# Altium project PCB_GREAT.PrjPCB
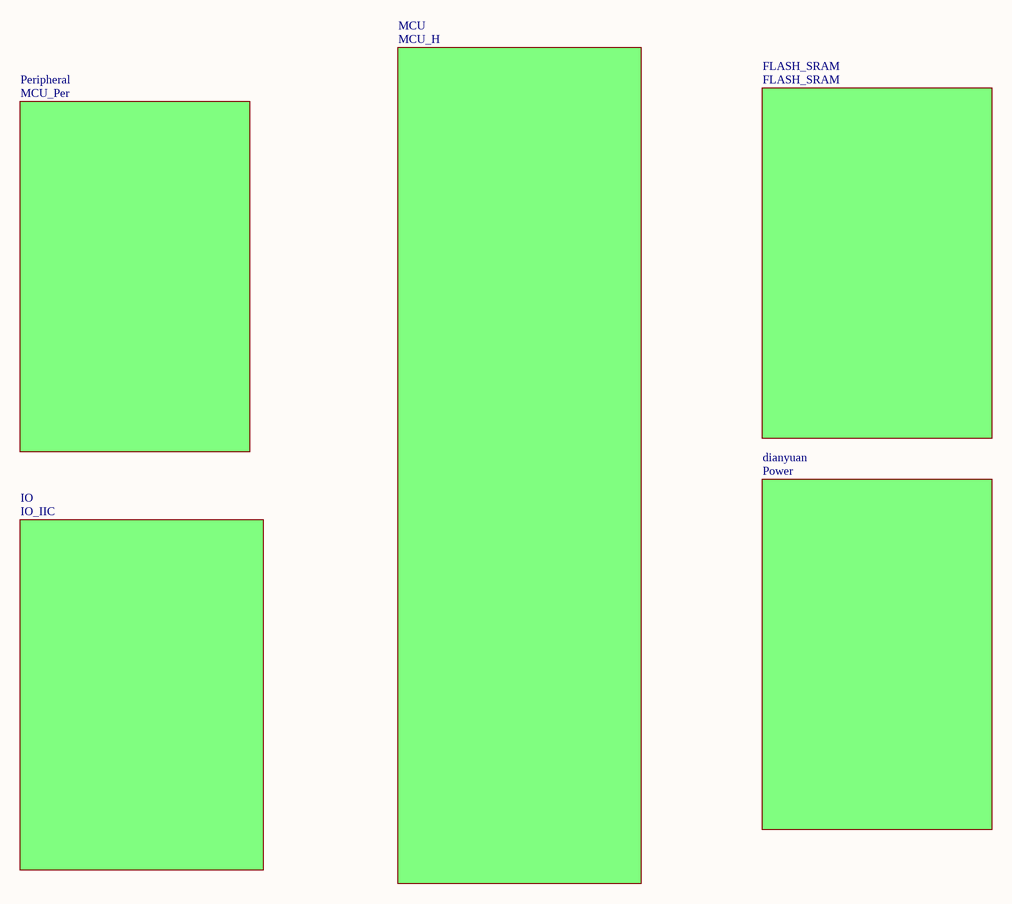
[diagram p0: H_TOP.SchDoc]
3 sheets, 67 parts. Net scope: flat (ports and power ports of the same name join across sheets).
Board file: F_300.PcbDoc
Sheets:
  H_TOP.SchDoc
    MCU = MCU_H.SchDoc
    FLASH_SRAM = FLASH_SRAM.SchDoc

## Sheet H_TOP.SchDoc
size A3

### Sub-sheets
dianyuan = Power (file not in this document): no entries
FLASH_SRAM = FLASH_SRAM: no entries
IO = IO_IIC (file not in this document): no entries
MCU = MCU_H: no entries
Peripheral = MCU_Per (file not in this document): no entries

## Sheet MCU_H.SchDoc
size A3
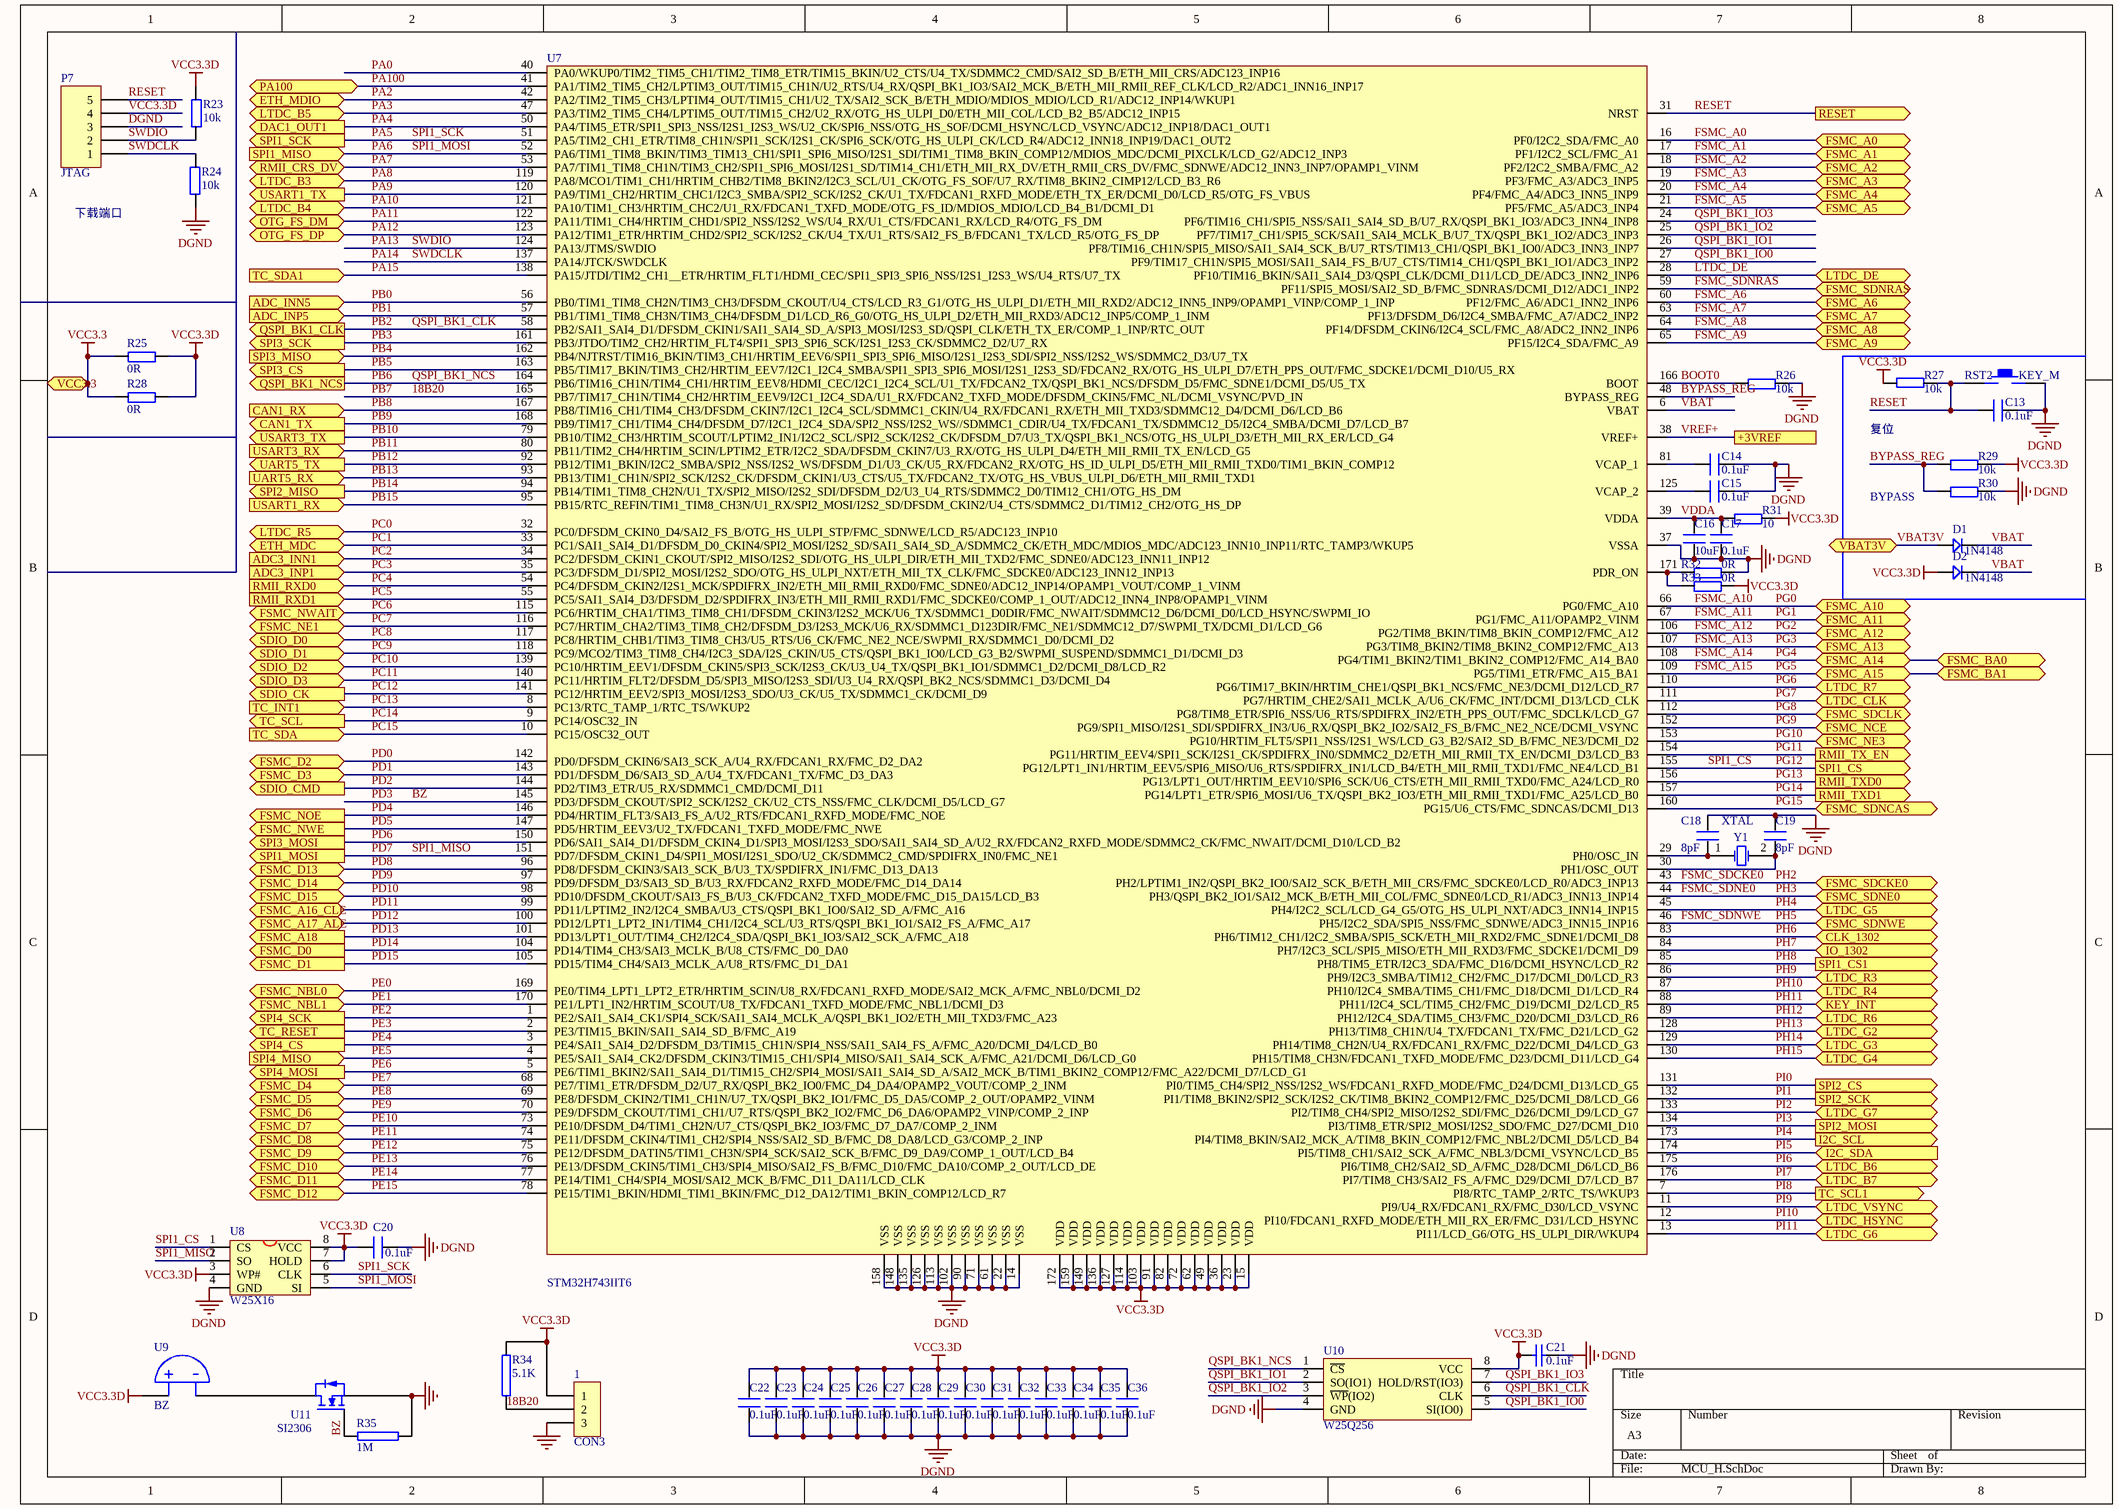
[diagram p1: MCU_H.SchDoc]

### Parts
1  CON3  [SIP3]
C13  0.1uF  [0603P]
C14  0.1uF  [0603P]
C15  0.1uF  [0603P]
C16  10uF  [0603P]
C17  0.1uF  [0603P]
C18  8pF  [0603P]
C19  8pF  [0603P]
C20  0.1uF  [0603P]
C21  0.1uF  [0603P]
C22  0.1uF  [0402]
C23  0.1uF  [0402]
C24  0.1uF  [0402]
C25  0.1uF  [0402]
C26  0.1uF  [0402]
C27  0.1uF  [0402]
C28  0.1uF  [0402]
C29  0.1uF  [0402]
C30  0.1uF  [0402]
C31  0.1uF  [0402]
C32  0.1uF  [0402]
C33  0.1uF  [0402]
C34  0.1uF  [0402]
C35  0.1uF  [0402]
C36  0.1uF  [0402]
D1  1N4148  [DIODE_SOP]
D2  1N4148  [DIODE_SOP]
P7  JTAG  [HDR1X5]
R23  10k  [0603P]
R24  10k  [0603P]
R25  0R  [0603P]
R26  10k  [0603P]
R27  10k  [0603P]
R28  0R  [0603P]
R29  10k  [0603P]
R30  10k  [0603P]
R31  10  [0603P]
R32  0R  [0603P]
R33  0R  [0603P]
R34  5.1K  [0603]
R35  1M  [0603]
RST2  KEY_M  [KEY_SOP3625]
U7  STM32H743IIT6  [STM32h743IIGT-NEW-LQFN-176N]
U8  W25X16  [SOIC-8]
U9  BZ  [BZ_SMALL]
U10  W25Q256  [WSON8]
U11  SI2306  [SOT-23]
Y1  XTAL  [XTAL1]

### Ports
+3VREF, ADC3_INN1 (in), ADC3_INP1 (in), ADC_INN5 (in), ADC_INP5 (in), CAN1_RX (in), CAN1_TX (out), CLK_1302 (bidir), DAC1_OUT1 (out), ETH_MDC (bidir), ETH_MDIO (bidir), FSMC_A0 (bidir), FSMC_A1 (bidir), FSMC_A2 (bidir), FSMC_A3 (bidir), FSMC_A4 (bidir), FSMC_A5 (bidir), FSMC_A6 (bidir), FSMC_A7 (bidir), FSMC_A8 (bidir), FSMC_A9 (bidir), FSMC_A10 (bidir), FSMC_A11 (bidir), FSMC_A12 (bidir), FSMC_A13 (bidir), FSMC_A14 (bidir), FSMC_A15 (bidir), FSMC_A16_CLE (bidir), FSMC_A17_ALE (bidir), FSMC_A18 (out), FSMC_BA0 (bidir), FSMC_BA1 (bidir), FSMC_D0 (out), FSMC_D1 (out), FSMC_D2 (bidir), FSMC_D3 (bidir), FSMC_D4 (bidir), FSMC_D5 (bidir), FSMC_D6 (bidir), FSMC_D7 (bidir), FSMC_D8 (bidir), FSMC_D9 (bidir), FSMC_D10 (bidir), FSMC_D11 (bidir), FSMC_D12 (bidir), FSMC_D13 (bidir), FSMC_D14 (bidir), FSMC_D15 (bidir), FSMC_NBL0 (bidir), FSMC_NBL1 (bidir), FSMC_NCE (bidir), FSMC_NE1 (bidir), FSMC_NE3 (bidir), FSMC_NOE (out), FSMC_NWAIT (bidir), FSMC_NWE (out), FSMC_SDCKE0 (bidir), FSMC_SDCLK (bidir), FSMC_SDNCAS (bidir), FSMC_SDNE0 (bidir), FSMC_SDNRAS (bidir), FSMC_SDNWE (bidir), I2C_SCL (out), I2C_SDA (in), IO_1302 (bidir), KEY_INT (bidir), LTDC_B3 (bidir), LTDC_B4 (bidir), LTDC_B5 (bidir), LTDC_B6 (bidir), LTDC_B7 (bidir), LTDC_CLK (bidir), LTDC_DE (bidir), LTDC_G2 (bidir), LTDC_G3 (bidir), LTDC_G4 (bidir), LTDC_G5 (bidir), LTDC_G6 (bidir), LTDC_G7 (bidir), LTDC_HSYNC (bidir), LTDC_R3 (bidir), LTDC_R4 (bidir), LTDC_R5 (bidir), LTDC_R6 (bidir), LTDC_R7 (bidir), LTDC_VSYNC (bidir), OTG_FS_DM (bidir), OTG_FS_DP (bidir), PA100, QSPI_BK1_CLK (out), QSPI_BK1_NCS (out), RESET (out), RMII_CRS_DV (bidir), RMII_RXD0 (in), RMII_RXD1 (in), RMII_TX_EN (out), RMII_TXD0 (out), RMII_TXD1 (out), SDIO_CK (out), SDIO_CMD (out), SDIO_D0 (bidir), SDIO_D1 (bidir), SDIO_D2 (bidir), SDIO_D3 (bidir), SPI1_CS1 (out), SPI1_CS (out), SPI1_MISO (in), SPI1_MOSI (out), SPI1_SCK (out), SPI2_CS (out), SPI2_MISO (out), SPI2_MOSI (out), SPI2_SCK (out), SPI3_CS (out), SPI3_MISO (in), SPI3_MOSI (out), SPI3_SCK (out), SPI4_CS (out), SPI4_MISO (in), SPI4_MOSI (out), SPI4_SCK (out), TC_INT1 (in), TC_RESET (out), TC_SCL1 (out), TC_SCL (out), TC_SDA1 (in), TC_SDA (in), UART5_RX (in), UART5_TX (out), USART1_RX (in), USART1_TX (out), USART3_RX (in), USART3_TX (out), VBAT3V, VCC3.3

### Nets
DGND: 1.3 C13.2 C14.2 C15.2 C16.1 C17.1 C18.2 C19.2 C20.2 C21.1 C22.1 C23.1 C24.1 C25.1 C26.1 C27.1 C28.1 C29.1 C30.1 C31.1 C32.1 C33.1 C34.1 C35.1 C36.1 P7.3 R24.2 R26.2 R30.2 R32.2 R35.1 RST2.2 U7.14(VSS) U7.22(VSS) U7.37(VSSA) U7.61(VSS) U7.71(VSS) U7.90(VSS) U7.102(VSS) U7.113(VSS) U7.126(VSS) U7.135(VSS) U7.148(VSS) U7.158(VSS) U8.4(GND) U10.4(GND) U11.E
VCC3.3: R25.1 R28.1 ; port VCC3.3
VCC3.3D: 1.1 C20.1 C21.2 C22.2 C23.2 C24.2 C25.2 C26.2 C27.2 C28.2 C29.2 C30.2 C31.2 C32.2 C33.2 C34.2 C35.2 C36.2 D2.1 P7.4 R23.2 R25.2 R27.2 R28.2 R29.2 R31.2 R33.2 R34.2 U7.15(VDD) U7.23(VDD) U7.36(VDD) U7.49(VDD) U7.62(VDD) U7.72(VDD) U7.82(VDD) U7.91(VDD) U7.103(VDD) U7.114(VDD) U7.127(VDD) U7.136(VDD) U7.149(VDD) U7.159(VDD) U7.172(VDD) U8.3(WP#) U8.7(HOLD) U8.8(VCC) U9.1 U10.8(VCC)
18B20: 1.2 R34.1 U7.165(PB7/TIM17_CH1N/TIM4_CH2/HRTIM_EEV9/I2C1_I2C4_SDA/U1_RX/FDCAN2_TXFD_MODE/DFSDM_CKIN5/FMC_NL/DCMI_VSYNC/PVD_IN)  [also labelled PB7]
BOOT0: R26.1 U7.166(BOOT)
BYPASS_REG: R29.1 R30.1 U7.48(BYPASS_REG)
BZ: R35.2 U7.145(PD3/DFSDM_CKOUT/SPI2_SCK/I2S2_CK/U2_CTS_NSS/FMC_CLK/DCMI_D5/LCD_G7) U11.B  [also labelled PD3]
FSMC_A0: U7.16(PF0/I2C2_SDA/FMC_A0) ; port FSMC_A0
FSMC_A1: U7.17(PF1/I2C2_SCL/FMC_A1) ; port FSMC_A1
FSMC_A2: U7.18(PF2/I2C2_SMBA/FMC_A2) ; port FSMC_A2
FSMC_A3: U7.19(PF3/FMC_A3/ADC3_INP5) ; port FSMC_A3
FSMC_A4: U7.20(PF4/FMC_A4/ADC3_INN5_INP9) ; port FSMC_A4
FSMC_A5: U7.21(PF5/FMC_A5/ADC3_INP4) ; port FSMC_A5
FSMC_A6: U7.60(PF12/FMC_A6/ADC1_INN2_INP6) ; port FSMC_A6
FSMC_A7: U7.63(PF13/DFSDM_D6/I2C4_SMBA/FMC_A7/ADC2_INP2) ; port FSMC_A7
FSMC_A8: U7.64(PF14/DFSDM_CKIN6/I2C4_SCL/FMC_A8/ADC2_INN2_INP6) ; port FSMC_A8
FSMC_A9: U7.65(PF15/I2C4_SDA/FMC_A9) ; port FSMC_A9
FSMC_A10: U7.66(PG0/FMC_A10) ; port FSMC_A10  [also labelled PG0]
FSMC_A11: U7.67(PG1/FMC_A11/OPAMP2_VINM) ; port FSMC_A11  [also labelled PG1]
FSMC_A12: U7.106(PG2/TIM8_BKIN/TIM8_BKIN_COMP12/FMC_A12) ; port FSMC_A12  [also labelled PG2]
FSMC_A13: U7.107(PG3/TIM8_BKIN2/TIM8_BKIN2_COMP12/FMC_A13) ; port FSMC_A13  [also labelled PG3]
FSMC_A14: U7.108(PG4/TIM1_BKIN2/TIM1_BKIN2_COMP12/FMC_A14_BA0) ; port FSMC_A14, port FSMC_BA0  [also labelled PG4]
FSMC_A15: U7.109(PG5/TIM1_ETR/FMC_A15_BA1) ; port FSMC_A15, port FSMC_BA1  [also labelled PG5]
FSMC_SDCKE0: U7.43(PH2/LPTIM1_IN2/QSPI_BK2_IO0/SAI2_SCK_B/ETH_MII_CRS/FMC_SDCKE0/LCD_R0/ADC3_INP13) ; port FSMC_SDCKE0  [also labelled PH2]
FSMC_SDNE0: U7.44(PH3/QSPI_BK2_IO1/SAI2_MCK_B/ETH_MII_COL/FMC_SDNE0/LCD_R1/ADC3_INN13_INP14) ; port FSMC_SDNE0  [also labelled PH3]
FSMC_SDNRAS: U7.59(PF11/SPI5_MOSI/SAI2_SD_B/FMC_SDNRAS/DCMI_D12/ADC1_INP2) ; port FSMC_SDNRAS
FSMC_SDNWE: U7.46(PH5/I2C2_SDA/SPI5_NSS/FMC_SDNWE/ADC3_INN15_INP16) ; port FSMC_SDNWE  [also labelled PH5]
LTDC_DE: U7.28(PF10/TIM16_BKIN/SAI1_SAI4_D3/QSPI_CLK/DCMI_D11/LCD_DE/ADC3_INN2_INP6) ; port LTDC_DE
PA0: U7.40(PA0/WKUP0/TIM2_TIM5_CH1/TIM2_TIM8_ETR/TIM15_BKIN/U2_CTS/U4_TX/SDMMC2_CMD/SAI2_SD_B/ETH_MII_CRS/ADC123_INP16)
PA2: U7.42(PA2/TIM2_TIM5_CH3/LPTIM4_OUT/TIM15_CH1/U2_TX/SAI2_SCK_B/ETH_MDIO/MDIOS_MDIO/LCD_R1/ADC12_INP14/WKUP1) ; port ETH_MDIO
PA3: U7.47(PA3/TIM2_TIM5_CH4/LPTIM5_OUT/TIM15_CH2/U2_RX/OTG_HS_ULPI_D0/ETH_MII_COL/LCD_B2_B5/ADC12_INP15) ; port LTDC_B5
PA4: U7.50(PA4/TIM5_ETR/SPI1_SPI3_NSS/I2S1_I2S3_WS/U2_CK/SPI6_NSS/OTG_HS_SOF/DCMI_HSYNC/LCD_VSYNC/ADC12_INP18/DAC1_OUT1) ; port DAC1_OUT1
PA5: U7.51(PA5/TIM2_CH1_ETR/TIM8_CH1N/SPI1_SCK/I2S1_CK/SPI6_SCK/OTG_HS_ULPI_CK/LCD_R4/ADC12_INN18_INP19/DAC1_OUT2) U8.6(CLK) ; port SPI1_SCK  [also labelled SPI1_SCK]
PA6: U7.52(PA6/TIM1_TIM8_BKIN/TIM3_TIM13_CH1/SPI1_SPI6_MISO/I2S1_SDI/TIM1_TIM8_BKIN_COMP12/MDIOS_MDC/DCMI_PIXCLK/LCD_G2/ADC12_INP3) U8.5(SI) ; port SPI1_MISO  [also labelled SPI1_MOSI]
PA7: U7.53(PA7/TIM1_TIM8_CH1N/TIM3_CH2/SPI1_SPI6_MOSI/I2S1_SD/TIM14_CH1/ETH_MII_RX_DV/ETH_RMII_CRS_DV/FMC_SDNWE/ADC12_INN3_INP7/OPAMP1_VINM) ; port RMII_CRS_DV
PA8: U7.119(PA8/MCO1/TIM1_CH1/HRTIM_CHB2/TIM8_BKIN2/I2C3_SCL/U1_CK/OTG_FS_SOF/U7_RX/TIM8_BKIN2_CIMP12/LCD_B3_R6) ; port LTDC_B3
PA9: U7.120(PA9/TIM1_CH2/HRTIM_CHC1/I2C3_SMBA/SPI2_SCK/I2S2_CK/U1_TX/FDCAN1_RXFD_MODE/ETH_TX_ER/DCMI_D0/LCD_R5/OTG_FS_VBUS) ; port USART1_TX
PA10: U7.121(PA10/TIM1_CH3/HRTIM_CHC2/U1_RX/FDCAN1_TXFD_MODE/OTG_FS_ID/MDIOS_MDIO/LCD_B4_B1/DCMI_D1) ; port LTDC_B4
PA11: U7.122(PA11/TIM1_CH4/HRTIM_CHD1/SPI2_NSS/I2S2_WS/U4_RX/U1_CTS/FDCAN1_RX/LCD_R4/OTG_FS_DM) ; port OTG_FS_DM
PA12: U7.123(PA12/TIM1_ETR/HRTIM_CHD2/SPI2_SCK/I2S2_CK/U4_TX/U1_RTS/SAI2_FS_B/FDCAN1_TX/LCD_R5/OTG_FS_DP) ; port OTG_FS_DP
PA13: P7.2 R23.1 U7.124(PA13/JTMS/SWDIO)  [also labelled SWDIO]
PA14: P7.1 R24.1 U7.137(PA14/JTCK/SWDCLK)  [also labelled SWDCLK]
PA15: U7.138(PA15/JTDI/TIM2_CH1__ETR/HRTIM_FLT1/HDMI_CEC/SPI1_SPI3_SPI6_NSS/I2S1_I2S3_WS/U4_RTS/U7_TX) ; port TC_SDA1
PA100: U7.41(PA1/TIM2_TIM5_CH2/LPTIM3_OUT/TIM15_CH1N/U2_RTS/U4_RX/QSPI_BK1_IO3/SAI2_MCK_B/ETH_MII_RMII_REF_CLK/LCD_R2/ADC1_INN16_INP17) ; port PA100
PB0: U7.56(PB0/TIM1_TIM8_CH2N/TIM3_CH3/DFSDM_CKOUT/U4_CTS/LCD_R3_G1/OTG_HS_ULPI_D1/ETH_MII_RXD2/ADC12_INN5_INP9/OPAMP1_VINP/COMP_1_INP) ; port ADC_INN5
PB1: U7.57(PB1/TIM1_TIM8_CH3N/TIM3_CH4/DFSDM_D1/LCD_R6_G0/OTG_HS_ULPI_D2/ETH_MII_RXD3/ADC12_INP5/COMP_1_INM) ; port ADC_INP5
PB2: U7.58(PB2/SAI1_SAI4_D1/DFSDM_CKIN1/SAI1_SAI4_SD_A/SPI3_MOSI/I2S3_SD/QSPI_CLK/ETH_TX_ER/COMP_1_INP/RTC_OUT) U10.6(CLK) ; port QSPI_BK1_CLK  [also labelled QSPI_BK1_CLK]
PB3: U7.161(PB3/JTDO/TIM2_CH2/HRTIM_FLT4/SPI1_SPI3_SPI6_SCK/I2S1_I2S3_CK/SDMMC2_D2/U7_RX) ; port SPI3_SCK
PB4: U7.162(PB4/NJTRST/TIM16_BKIN/TIM3_CH1/HRTIM_EEV6/SPI1_SPI3_SPI6_MISO/I2S1_I2S3_SDI/SPI2_NSS/I2S2_WS/SDMMC2_D3/U7_TX) ; port SPI3_MISO
PB5: U7.163(PB5/TIM17_BKIN/TIM3_CH2/HRTIM_EEV7/I2C1_I2C4_SMBA/SPI1_SPI3_SPI6_MOSI/I2S1_I2S3_SD/FDCAN2_RX/OTG_HS_ULPI_D7/ETH_PPS_OUT/FMC_SDCKE1/DCMI_D10/U5_RX) ; port SPI3_CS
PB6: U7.164(PB6/TIM16_CH1N/TIM4_CH1/HRTIM_EEV8/HDMI_CEC/I2C1_I2C4_SCL/U1_TX/FDCAN2_TX/QSPI_BK1_NCS/DFSDM_D5/FMC_SDNE1/DCMI_D5/U5_TX) U10.1(~{CS}) ; port QSPI_BK1_NCS  [also labelled QSPI_BK1_NCS]
PB8: U7.167(PB8/TIM16_CH1/TIM4_CH3/DFSDM_CKIN7/I2C1_I2C4_SCL/SDMMC1_CKIN/U4_RX/FDCAN1_RX/ETH_MII_TXD3/SDMMC12_D4/DCMI_D6/LCD_B6) ; port CAN1_RX
PB9: U7.168(PB9/TIM17_CH1/TIM4_CH4/DFSDM_D7/I2C1_I2C4_SDA/SPI2_NSS/I2S2_WS//SDMMC1_CDIR/U4_TX/FDCAN1_TX/SDMMC12_D5/I2C4_SMBA/DCMI_D7/LCD_B7) ; port CAN1_TX
PB10: U7.79(PB10/TIM2_CH3/HRTIM_SCOUT/LPTIM2_IN1/I2C2_SCL/SPI2_SCK/I2S2_CK/DFSDM_D7/U3_TX/QSPI_BK1_NCS/OTG_HS_ULPI_D3/ETH_MII_RX_ER/LCD_G4) ; port USART3_TX
PB11: U7.80(PB11/TIM2_CH4/HRTIM_SCIN/LPTIM2_ETR/I2C2_SDA/DFSDM_CKIN7/U3_RX/OTG_HS_ULPI_D4/ETH_MII_RMII_TX_EN/LCD_G5) ; port USART3_RX
PB12: U7.92(PB12/TIM1_BKIN/I2C2_SMBA/SPI2_NSS/I2S2_WS/DFSDM_D1/U3_CK/U5_RX/FDCAN2_RX/OTG_HS_ID_ULPI_D5/ETH_MII_RMII_TXD0/TIM1_BKIN_COMP12) ; port UART5_TX
PB13: U7.93(PB13/TIM1_CH1N/SPI2_SCK/I2S2_CK/DFSDM_CKIN1/U3_CTS/U5_TX/FDCAN2_TX/OTG_HS_VBUS_ULPI_D6/ETH_MII_RMII_TXD1) ; port UART5_RX
PB14: U7.94(PB14/TIM1_TIM8_CH2N/U1_TX/SPI2_MISO/I2S2_SDI/DFSDM_D2/U3_U4_RTS/SDMMC2_D0/TIM12_CH1/OTG_HS_DM) ; port SPI2_MISO
PB15: U7.95(PB15/RTC_REFIN/TIM1_TIM8_CH3N/U1_RX/SPI2_MOSI/I2S2_SD/DFSDM_CKIN2/U4_CTS/SDMMC2_D1/TIM12_CH2/OTG_HS_DP) ; port USART1_RX
PC0: U7.32(PC0/DFSDM_CKIN0_D4/SAI2_FS_B/OTG_HS_ULPI_STP/FMC_SDNWE/LCD_R5/ADC123_INP10) ; port LTDC_R5
PC1: U7.33(PC1/SAI1_SAI4_D1/DFSDM_D0_CKIN4/SPI2_MOSI/I2S2_SD/SAI1_SAI4_SD_A/SDMMC2_CK/ETH_MDC/MDIOS_MDC/ADC123_INN10_INP11/RTC_TAMP3/WKUP5) ; port ETH_MDC
PC2: U7.34(PC2/DFSDM_CKIN1_CKOUT/SPI2_MISO/I2S2_SDI/OTG_HS_ULPI_DIR/ETH_MII_TXD2/FMC_SDNE0/ADC123_INN11_INP12) ; port ADC3_INN1
PC3: U7.35(PC3/DFSDM_D1/SPI2_MOSI/I2S2_SDO/OTG_HS_ULPI_NXT/ETH_MII_TX_CLK/FMC_SDCKE0/ADC123_INN12_INP13) ; port ADC3_INP1
PC4: U7.54(PC4/DFSDM_CKIN2/I2S1_MCK/SPDIFRX_IN2/ETH_MII_RMII_RXD0/FMC_SDNE0/ADC12_INP14/OPAMP1_VOUT/COMP_1_VINM) ; port RMII_RXD0
PC5: U7.55(PC5/SAI1_SAI4_D3/DFSDM_D2/SPDIFRX_IN3/ETH_MII_RMII_RXD1/FMC_SDCKE0/COMP_1_OUT/ADC12_INN4_INP8/OPAMP1_VINM) ; port RMII_RXD1
PC6: U7.115(PC6/HRTIM_CHA1/TIM3_TIM8_CH1/DFSDM_CKIN3/I2S2_MCK/U6_TX/SDMMC1_D0DIR/FMC_NWAIT/SDMMC12_D6/DCMI_D0/LCD_HSYNC/SWPMI_IO) ; port FSMC_NWAIT
PC7: U7.116(PC7/HRTIM_CHA2/TIM3_TIM8_CH2/DFSDM_D3/I2S3_MCK/U6_RX/SDMMC1_D123DIR/FMC_NE1/SDMMC12_D7/SWPMI_TX/DCMI_D1/LCD_G6) ; port FSMC_NE1
PC8: U7.117(PC8/HRTIM_CHB1/TIM3_TIM8_CH3/U5_RTS/U6_CK/FMC_NE2_NCE/SWPMI_RX/SDMMC1_D0/DCMI_D2) ; port SDIO_D0
PC9: U7.118(PC9/MCO2/TIM3_TIM8_CH4/I2C3_SDA/I2S_CKIN/U5_CTS/QSPI_BK1_IO0/LCD_G3_B2/SWPMI_SUSPEND/SDMMC1_D1/DCMI_D3) ; port SDIO_D1
PC10: U7.139(PC10/HRTIM_EEV1/DFSDM_CKIN5/SPI3_SCK/I2S3_CK/U3_U4_TX/QSPI_BK1_IO1/SDMMC1_D2/DCMI_D8/LCD_R2) ; port SDIO_D2
PC11: U7.140(PC11/HRTIM_FLT2/DFSDM_D5/SPI3_MISO/I2S3_SDI/U3_U4_RX/QSPI_BK2_NCS/SDMMC1_D3/DCMI_D4) ; port SDIO_D3
PC12: U7.141(PC12/HRTIM_EEV2/SPI3_MOSI/I2S3_SDO/U3_CK/U5_TX/SDMMC1_CK/DCMI_D9) ; port SDIO_CK
PC13: U7.8(PC13/RTC_TAMP_1/RTC_TS/WKUP2) ; port TC_INT1
PC14: U7.9(PC14/OSC32_IN) ; port TC_SCL
PC15: U7.10(PC15/OSC32_OUT) ; port TC_SDA
PD0: U7.142(PD0/DFSDM_CKIN6/SAI3_SCK_A/U4_RX/FDCAN1_RX/FMC_D2_DA2) ; port FSMC_D2  [project net FSMC_D2]
PD1: U7.143(PD1/DFSDM_D6/SAI3_SD_A/U4_TX/FDCAN1_TX/FMC_D3_DA3) ; port FSMC_D3  [project net FSMC_D3]
PD2: U7.144(PD2/TIM3_ETR/U5_RX/SDMMC1_CMD/DCMI_D11) ; port SDIO_CMD
PD4: U7.146(PD4/HRTIM_FLT3/SAI3_FS_A/U2_RTS/FDCAN1_RXFD_MODE/FMC_NOE) ; port FSMC_NOE  [project net FSMC_NOE]
PD5: U7.147(PD5/HRTIM_EEV3/U2_TX/FDCAN1_TXFD_MODE/FMC_NWE) ; port FSMC_NWE  [project net FSMC_NWE]
PD6: U7.150(PD6/SAI1_SAI4_D1/DFSDM_CKIN4_D1/SPI3_MOSI/I2S3_SDO/SAI1_SAI4_SD_A/U2_RX/FDCAN2_RXFD_MODE/SDMMC2_CK/FMC_NWAIT/DCMI_D10/LCD_B2) ; port SPI3_MOSI
PD7: U7.151(PD7/DFSDM_CKIN1_D4/SPI1_MOSI/I2S1_SDO/U2_CK/SDMMC2_CMD/SPDIFRX_IN0/FMC_NE1) U8.2(SO) ; port SPI1_MOSI  [also labelled SPI1_MISO]
PD8: U7.96(PD8/DFSDM_CKIN3/SAI3_SCK_B/U3_TX/SPDIFRX_IN1/FMC_D13_DA13) ; port FSMC_D13  [project net FSMC_D13]
PD9: U7.97(PD9/DFSDM_D3/SAI3_SD_B/U3_RX/FDCAN2_RXFD_MODE/FMC_D14_DA14) ; port FSMC_D14  [project net FSMC_D14]
PD10: U7.98(PD10/DFSDM_CKOUT/SAI3_FS_B/U3_CK/FDCAN2_TXFD_MODE/FMC_D15_DA15/LCD_B3) ; port FSMC_D15  [project net FSMC_D15]
PD11: U7.99(PD11/LPTIM2_IN2/I2C4_SMBA/U3_CTS/QSPI_BK1_IO0/SAI2_SD_A/FMC_A16) ; port FSMC_A16_CLE  [project net FSMC_A16]
PD12: U7.100(PD12/LPT1_LPT2_IN1/TIM4_CH1/I2C4_SCL/U3_RTS/QSPI_BK1_IO1/SAI2_FS_A/FMC_A17) ; port FSMC_A17_ALE  [project net FSMC_A17]
PD13: U7.101(PD13/LPT1_OUT/TIM4_CH2/I2C4_SDA/QSPI_BK1_IO3/SAI2_SCK_A/FMC_A18) ; port FSMC_A18  [project net FSMC_A18]
PD14: U7.104(PD14/TIM4_CH3/SAI3_MCLK_B/U8_CTS/FMC_D0_DA0) ; port FSMC_D0  [project net FSMC_D0]
PD15: U7.105(PD15/TIM4_CH4/SAI3_MCLK_A/U8_RTS/FMC_D1_DA1) ; port FSMC_D1  [project net FSMC_D1]
PE0: U7.169(PE0/TIM4_LPT1_LPT2_ETR/HRTIM_SCIN/U8_RX/FDCAN1_RXFD_MODE/SAI2_MCK_A/FMC_NBL0/DCMI_D2) ; port FSMC_NBL0
PE1: U7.170(PE1/LPT1_IN2/HRTIM_SCOUT/U8_TX/FDCAN1_TXFD_MODE/FMC_NBL1/DCMI_D3) ; port FSMC_NBL1
PE2: U7.1(PE2/SAI1_SAI4_CK1/SPI4_SCK/SAI1_SAI4_MCLK_A/QSPI_BK1_IO2/ETH_MII_TXD3/FMC_A23) ; port SPI4_SCK
PE3: U7.2(PE3/TIM15_BKIN/SAI1_SAI4_SD_B/FMC_A19) ; port TC_RESET
PE4: U7.3(PE4/SAI1_SAI4_D2/DFSDM_D3/TIM15_CH1N/SPI4_NSS/SAI1_SAI4_FS_A/FMC_A20/DCMI_D4/LCD_B0) ; port SPI4_CS
PE5: U7.4(PE5/SAI1_SAI4_CK2/DFSDM_CKIN3/TIM15_CH1/SPI4_MISO/SAI1_SAI4_SCK_A/FMC_A21/DCMI_D6/LCD_G0) ; port SPI4_MISO
PE6: U7.5(PE6/TIM1_BKIN2/SAI1_SAI4_D1/TIM15_CH2/SPI4_MOSI/SAI1_SAI4_SD_A/SAI2_MCK_B/TIM1_BKIN2_COMP12/FMC_A22/DCMI_D7/LCD_G1) ; port SPI4_MOSI
PE7: U7.68(PE7/TIM1_ETR/DFSDM_D2/U7_RX/QSPI_BK2_IO0/FMC_D4_DA4/OPAMP2_VOUT/COMP_2_INM) ; port FSMC_D4  [project net FSMC_D4]
PE8: U7.69(PE8/DFSDM_CKIN2/TIM1_CH1N/U7_TX/QSPI_BK2_IO1/FMC_D5_DA5/COMP_2_OUT/OPAMP2_VINM) ; port FSMC_D5  [project net FSMC_D5]
PE9: U7.70(PE9/DFSDM_CKOUT/TIM1_CH1/U7_RTS/QSPI_BK2_IO2/FMC_D6_DA6/OPAMP2_VINP/COMP_2_INP) ; port FSMC_D6  [project net FSMC_D6]
PE10: U7.73(PE10/DFSDM_D4/TIM1_CH2N/U7_CTS/QSPI_BK2_IO3/FMC_D7_DA7/COMP_2_INM) ; port FSMC_D7  [project net FSMC_D7]
PE11: U7.74(PE11/DFSDM_CKIN4/TIM1_CH2/SPI4_NSS/SAI2_SD_B/FMC_D8_DA8/LCD_G3/COMP_2_INP) ; port FSMC_D8  [project net FSMC_D8]
PE12: U7.75(PE12/DFSDM_DATIN5/TIM1_CH3N/SPI4_SCK/SAI2_SCK_B/FMC_D9_DA9/COMP_1_OUT/LCD_B4) ; port FSMC_D9  [project net FSMC_D9]
PE13: U7.76(PE13/DFSDM_CKIN5/TIM1_CH3/SPI4_MISO/SAI2_FS_B/FMC_D10/FMC_DA10/COMP_2_OUT/LCD_DE) ; port FSMC_D10  [project net FSMC_D10]
PE14: U7.77(PE14/TIM1_CH4/SPI4_MOSI/SAI2_MCK_B/FMC_D11_DA11/LCD_CLK) ; port FSMC_D11  [project net FSMC_D11]
PE15: U7.78(PE15/TIM1_BKIN/HDMI_TIM1_BKIN/FMC_D12_DA12/TIM1_BKIN_COMP12/LCD_R7) ; port FSMC_D12  [project net FSMC_D12]
PG6: U7.110(PG6/TIM17_BKIN/HRTIM_CHE1/QSPI_BK1_NCS/FMC_NE3/DCMI_D12/LCD_R7) ; port LTDC_R7
PG7: U7.111(PG7/HRTIM_CHE2/SAI1_MCLK_A/U6_CK/FMC_INT/DCMI_D13/LCD_CLK) ; port LTDC_CLK
PG8: U7.112(PG8/TIM8_ETR/SPI6_NSS/U6_RTS/SPDIFRX_IN2/ETH_PPS_OUT/FMC_SDCLK/LCD_G7) ; port FSMC_SDCLK  [project net FSMC_SDCLK]
PG9: U7.152(PG9/SPI1_MISO/I2S1_SDI/SPDIFRX_IN3/U6_RX/QSPI_BK2_IO2/SAI2_FS_B/FMC_NE2_NCE/DCMI_VSYNC) ; port FSMC_NCE
PG10: U7.153(PG10/HRTIM_FLT5/SPI1_NSS/I2S1_WS/LCD_G3_B2/SAI2_SD_B/FMC_NE3/DCMI_D2) ; port FSMC_NE3  [project net FSMC_NE3]
PG11: U7.154(PG11/HRTIM_EEV4/SPI1_SCK/I2S1_CK/SPDIFRX_IN0/SDMMC2_D2/ETH_MII_RMII_TX_EN/DCMI_D3/LCD_B3) ; port RMII_TX_EN
PG12: U7.155(PG12/LPT1_IN1/HRTIM_EEV5/SPI6_MISO/U6_RTS/SPDIFRX_IN1/LCD_B4/ETH_MII_RMII_TXD1/FMC_NE4/LCD_B1) U8.1(CS) ; port SPI1_CS  [also labelled SPI1_CS]
PG13: U7.156(PG13/LPT1_OUT/HRTIM_EEV10/SPI6_SCK/U6_CTS/ETH_MII_RMII_TXD0/FMC_A24/LCD_R0) ; port RMII_TXD0
PG14: U7.157(PG14/LPT1_ETR/SPI6_MOSI/U6_TX/QSPI_BK2_IO3/ETH_MII_RMII_TXD1/FMC_A25/LCD_B0) ; port RMII_TXD1
PG15: U7.160(PG15/U6_CTS/FMC_SDNCAS/DCMI_D13) ; port FSMC_SDNCAS
PH4: U7.45(PH4/I2C2_SCL/LCD_G4_G5/OTG_HS_ULPI_NXT/ADC3_INN14_INP15) ; port LTDC_G5
PH6: U7.83(PH6/TIM12_CH1/I2C2_SMBA/SPI5_SCK/ETH_MII_RXD2/FMC_SDNE1/DCMI_D8) ; port CLK_1302
PH7: U7.84(PH7/I2C3_SCL/SPI5_MISO/ETH_MII_RXD3/FMC_SDCKE1/DCMI_D9) ; port IO_1302
PH8: U7.85(PH8/TIM5_ETR/I2C3_SDA/FMC_D16/DCMI_HSYNC/LCD_R2) ; port SPI1_CS1
PH9: U7.86(PH9/I2C3_SMBA/TIM12_CH2/FMC_D17/DCMI_D0/LCD_R3) ; port LTDC_R3
PH10: U7.87(PH10/I2C4_SMBA/TIM5_CH1/FMC_D18/DCMI_D1/LCD_R4) ; port LTDC_R4
PH11: U7.88(PH11/I2C4_SCL/TIM5_CH2/FMC_D19/DCMI_D2/LCD_R5) ; port KEY_INT
PH12: U7.89(PH12/I2C4_SDA/TIM5_CH3/FMC_D20/DCMI_D3/LCD_R6) ; port LTDC_R6
PH13: U7.128(PH13/TIM8_CH1N/U4_TX/FDCAN1_TX/FMC_D21/LCD_G2) ; port LTDC_G2
PH14: U7.129(PH14/TIM8_CH2N/U4_RX/FDCAN1_RX/FMC_D22/DCMI_D4/LCD_G3) ; port LTDC_G3
PH15: U7.130(PH15/TIM8_CH3N/FDCAN1_TXFD_MODE/FMC_D23/DCMI_D11/LCD_G4) ; port LTDC_G4
PI0: U7.131(PI0/TIM5_CH4/SPI2_NSS/I2S2_WS/FDCAN1_RXFD_MODE/FMC_D24/DCMI_D13/LCD_G5) ; port SPI2_CS
PI1: U7.132(PI1/TIM8_BKIN2/SPI2_SCK/I2S2_CK/TIM8_BKIN2_COMP12/FMC_D25/DCMI_D8/LCD_G6) ; port SPI2_SCK
PI2: U7.133(PI2/TIM8_CH4/SPI2_MISO/I2S2_SDI/FMC_D26/DCMI_D9/LCD_G7) ; port LTDC_G7
PI3: U7.134(PI3/TIM8_ETR/SPI2_MOSI/I2S2_SDO/FMC_D27/DCMI_D10) ; port SPI2_MOSI
PI4: U7.173(PI4/TIM8_BKIN/SAI2_MCK_A/TIM8_BKIN_COMP12/FMC_NBL2/DCMI_D5/LCD_B4) ; port I2C_SCL
PI5: U7.174(PI5/TIM8_CH1/SAI2_SCK_A/FMC_NBL3/DCMI_VSYNC/LCD_B5) ; port I2C_SDA
PI6: U7.175(PI6/TIM8_CH2/SAI2_SD_A/FMC_D28/DCMI_D6/LCD_B6) ; port LTDC_B6
PI7: U7.176(PI7/TIM8_CH3/SAI2_FS_A/FMC_D29/DCMI_D7/LCD_B7) ; port LTDC_B7
PI8: U7.7(PI8/RTC_TAMP_2/RTC_TS/WKUP3) ; port TC_SCL1
PI9: U7.11(PI9/U4_RX/FDCAN1_RX/FMC_D30/LCD_VSYNC) ; port LTDC_VSYNC
PI10: U7.12(PI10/FDCAN1_RXFD_MODE/ETH_MII_RX_ER/FMC_D31/LCD_HSYNC) ; port LTDC_HSYNC
PI11: U7.13(PI11/LCD_G6/OTG_HS_ULPI_DIR/WKUP4) ; port LTDC_G6
QSPI_BK1_IO0: U7.27(PF9/TIM17_CH1N/SPI5_MOSI/SAI1_SAI4_FS_B/U7_CTS/TIM14_CH1/QSPI_BK1_IO1/ADC3_INP2) U10.5(SI(IO0))
QSPI_BK1_IO1: U7.26(PF8/TIM16_CH1N/SPI5_MISO/SAI1_SAI4_SCK_B/U7_RTS/TIM13_CH1/QSPI_BK1_IO0/ADC3_INN3_INP7) U10.2(SO(IO1))
QSPI_BK1_IO2: U7.25(PF7/TIM17_CH1/SPI5_SCK/SAI1_SAI4_MCLK_B/U7_TX/QSPI_BK1_IO2/ADC3_INP3) U10.3(~{WP}(IO2))
QSPI_BK1_IO3: U7.24(PF6/TIM16_CH1/SPI5_NSS/SAI1_SAI4_SD_B/U7_RX/QSPI_BK1_IO3/ADC3_INN4_INP8) U10.7(HOLD/RST(IO3))
RESET: C13.1 P7.5 R27.1 RST2.1 U7.31(NRST) ; port RESET
VBAT: D1.2 D2.2 U7.6(VBAT)
VBAT3V: D1.1 ; port VBAT3V
VDDA: C16.2 C17.2 R31.1 U7.39(VDDA)
VREF+: U7.38(VREF+) ; port +3VREF
NetC14_1: C14.1 U7.81(VCAP_1)
NetC15_1: C15.1 U7.125(VCAP_2)
NetC18_1: C18.1 U7.29(PH0/OSC_IN) Y1.1(OSC1)
NetC19_1: C19.1 U7.30(PH1/OSC_OUT) Y1.2(OSC2)
NetR32_1: R32.1 R33.1 U7.171(PDR_ON)
NetU9_2: U9.2 U11.C

### Notes on the sheet
- 下载端口
- (near R27) 复位
- BYPASS

### Library data of the parts
1 = CON3: Connector
C13-C20 C22-C36 = C
C21 = Cap: Capacitor; Value: 100pF; Published: 8-Jun-2000; LatestRevisionDate: 17-Jul-2002; LatestRevisionNote: Re-released for DXP Platform.; PackageReference: RAD-0.3; Publisher: Altium Limited; PackageDescription: Radial Cap, Thru-Hole; 2 Leads; 0.3 in Pin Spacing
D1 D2 = D
P7 = Header 5: Header, 5-Pin; LatestRevisionDate: 17-Jul-2002; LatestRevisionNote: Re-released for DXP Platform.; Publisher: Altium Limited
R23-R33 = R
R34 R35 = RES
U8 = W25X16: W25X16;SST25VF016;MX25L1605
U10 = W25Q128
U11 = MOFET_N
Y1 = XTAL: Crystal Oscillator; Published: 8-Jun-2000; LatestRevisionDate: 17-Jul-2002; LatestRevisionNote: Re-released for DXP Platform.; PackageReference: R38; Publisher: Altium Limited; PackageDescription: Crystal, Thru-Hole; 2 Leads; Body 3.1 x 8.2 mm (Dia.xH)

## Sheet FLASH_SRAM.SchDoc
size A3
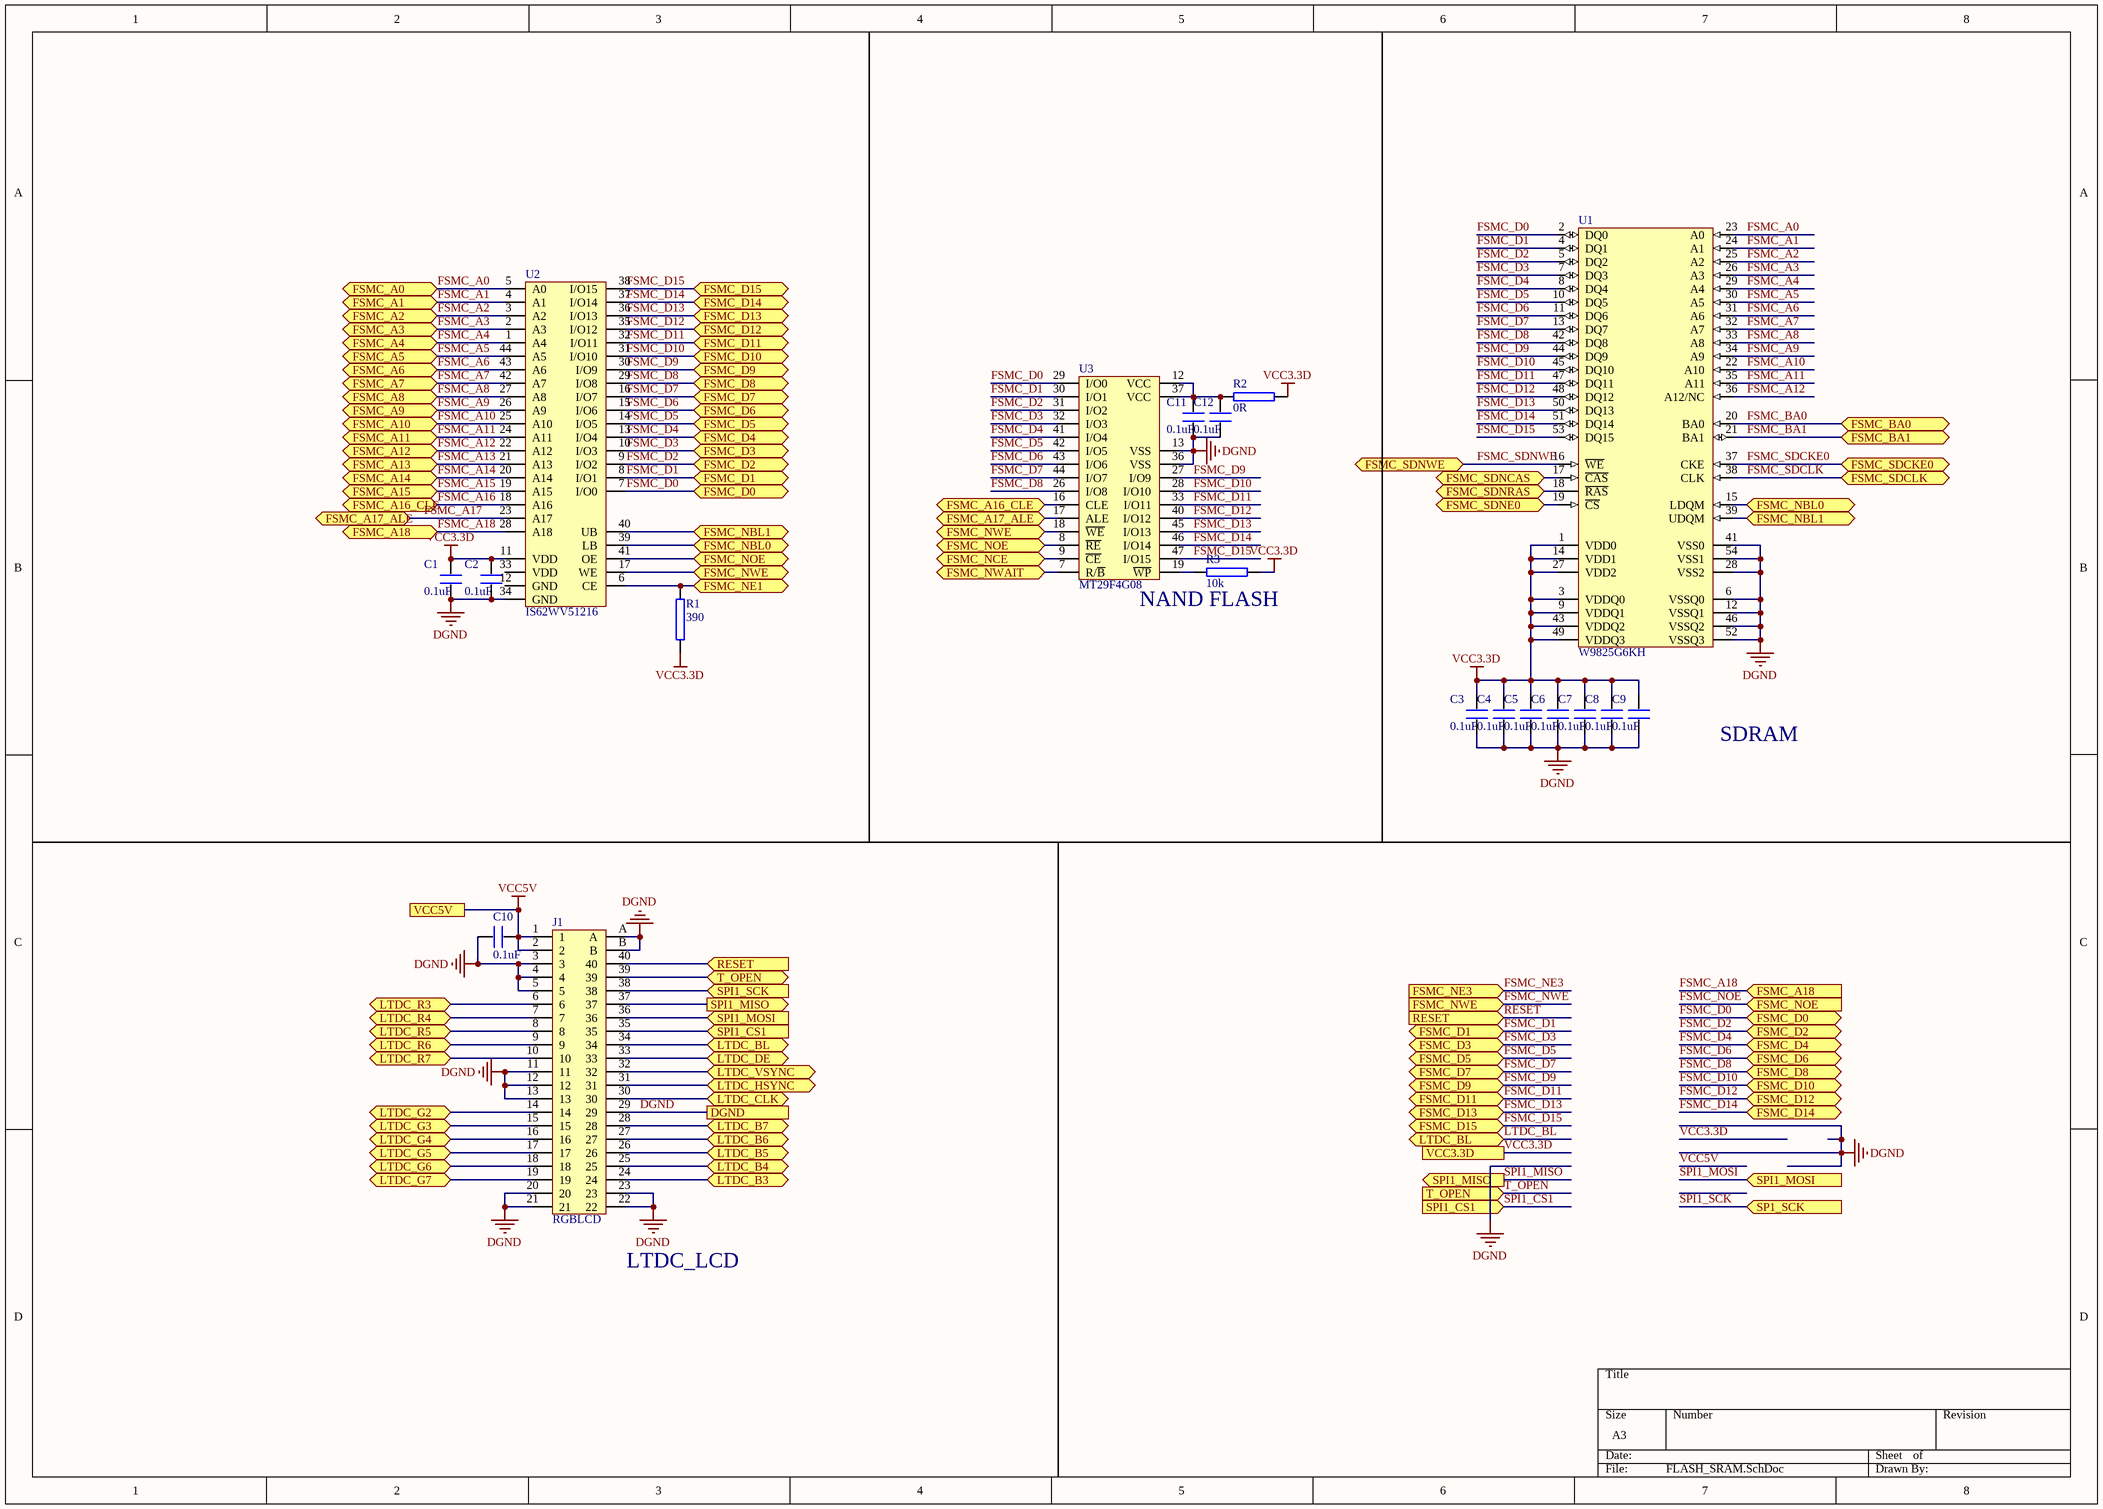
[diagram p2: FLASH_SRAM.SchDoc]

### Parts
C1  0.1uF  [0603P]
C2  0.1uF  [0603P]
C3  0.1uF  [0603P]
C4  0.1uF  [0603P]
C5  0.1uF  [0603P]
C6  0.1uF  [0603P]
C7  0.1uF  [0603P]
C8  0.1uF  [0603P]
C9  0.1uF  [0603P]
C10  0.1uF  [0603P]
C11  0.1uF  [0603P]
C12  0.1uF  [0603P]
J1  RGBLCD  [FPC-TOP40]
R1  390  [0603]
R2  0R  [0603]
R3  10k  [0603]
U1  W9825G6KH  [TSOP54]
U2  IS62WV51216  [TSOP44]
U3  MT29F4G08  [TSOP48]

### Ports
DGND, FSMC_A0 (bidir), FSMC_A1 (bidir), FSMC_A2 (bidir), FSMC_A3 (bidir), FSMC_A4 (bidir), FSMC_A5 (bidir), FSMC_A6 (bidir), FSMC_A7 (bidir), FSMC_A8 (bidir), FSMC_A9 (bidir), FSMC_A10 (bidir), FSMC_A11 (bidir), FSMC_A12 (bidir), FSMC_A13 (bidir), FSMC_A14 (bidir), FSMC_A15 (bidir), FSMC_A16_CLE (bidir), FSMC_A17_ALE (bidir), FSMC_A18 (bidir), FSMC_A18 (in), FSMC_BA0 (bidir), FSMC_BA1 (bidir), FSMC_D0 (bidir), FSMC_D1 (bidir), FSMC_D2 (bidir), FSMC_D3 (bidir), FSMC_D4 (bidir), FSMC_D5 (bidir), FSMC_D6 (bidir), FSMC_D7 (bidir), FSMC_D8 (bidir), FSMC_D9 (bidir), FSMC_D10 (bidir), FSMC_D11 (bidir), FSMC_D12 (bidir), FSMC_D13 (bidir), FSMC_D14 (bidir), FSMC_D15 (bidir), FSMC_NBL0 (bidir), FSMC_NBL1 (bidir), FSMC_NCE (bidir), FSMC_NE1 (bidir), FSMC_NE3 (in), FSMC_NOE (bidir), FSMC_NOE (in), FSMC_NWAIT (bidir), FSMC_NWE (bidir), FSMC_NWE (in), FSMC_SDCKE0 (bidir), FSMC_SDCLK (bidir), FSMC_SDNCAS (bidir), FSMC_SDNE0 (bidir), FSMC_SDNRAS (bidir), FSMC_SDNWE (bidir), LTDC_B3 (bidir), LTDC_B4 (bidir), LTDC_B5 (bidir), LTDC_B6 (bidir), LTDC_B7 (bidir), LTDC_BL, LTDC_BL (bidir), LTDC_CLK (bidir), LTDC_DE (bidir), LTDC_G2 (bidir), LTDC_G3 (bidir), LTDC_G4 (bidir), LTDC_G5 (bidir), LTDC_G6 (bidir), LTDC_G7 (bidir), LTDC_HSYNC (bidir), LTDC_R3 (bidir), LTDC_R4 (bidir), LTDC_R5 (bidir), LTDC_R6 (bidir), LTDC_R7 (bidir), LTDC_VSYNC (bidir), RESET (in), SP1_SCK (in), SPI1_CS1 (in), SPI1_MISO (out), SPI1_MOSI (in), SPI1_SCK (in), T_OPEN (bidir), T_OPEN (in), VCC3.3D, VCC5V

### Nets
DGND: C1.2 C2.2 C3.2 C4.2 C5.2 C6.2 C7.2 C8.2 C9.2 C10.2 C11.2 C12.2 J1.3 J1.4 J1.5 J1.11 J1.12 J1.13 J1.20 J1.21 J1.22 J1.23 J1.29 J1.A J1.B U1.6(VSSQ0) U1.12(VSSQ1) U1.28(VSS2) U1.41(VSS0) U1.46(VSSQ2) U1.52(VSSQ3) U1.54(VSS1) U2.34(GND) U3.13(VSS) U3.36(VSS) ; port DGND
VCC3.3D: C1.1 C2.1 C3.1 C4.1 C5.1 C6.1 C7.1 C8.1 C9.1 R1.2 R2.1 R3.1 U1.1(VDD0) U1.3(VDDQ0) U1.9(VDDQ1) U1.14(VDD1) U1.27(VDD2) U1.43(VDDQ2) U1.49(VDDQ3) U2.11(VDD) ; port VCC3.3D
VCC5V: C10.1 J1.1 J1.2 ; port VCC5V
FSMC_A0: U1.23(A0) U2.5(A0) ; port FSMC_A0
FSMC_A1: U1.24(A1) U2.4(A1) ; port FSMC_A1
FSMC_A2: U1.25(A2) U2.3(A2) ; port FSMC_A2
FSMC_A3: U1.26(A3) U2.2(A3) ; port FSMC_A3
FSMC_A4: U1.29(A4) U2.1(A4) ; port FSMC_A4
FSMC_A5: U1.30(A5) U2.44(A5) ; port FSMC_A5
FSMC_A6: U1.31(A6) U2.43(A6) ; port FSMC_A6
FSMC_A7: U1.32(A7) U2.42(A7) ; port FSMC_A7
FSMC_A8: U1.33(A8) U2.27(A8) ; port FSMC_A8
FSMC_A9: U1.34(A9) U2.26(A9) ; port FSMC_A9
FSMC_A10: U1.22(A10) U2.25(A10) ; port FSMC_A10
FSMC_A11: U1.35(A11) U2.24(A11) ; port FSMC_A11
FSMC_A12: U1.36(A12/NC) U2.22(A12) ; port FSMC_A12
FSMC_A13: U2.21(A13) ; port FSMC_A13
FSMC_A14: U1.20(BA0) U2.20(A14) ; port FSMC_A14, port FSMC_BA0  [also labelled FSMC_BA0]
FSMC_A15: U1.21(BA1) U2.19(A15) ; port FSMC_A15, port FSMC_BA1  [also labelled FSMC_BA1]
FSMC_A16: U2.18(A16) U3.16(CLE) ; port FSMC_A16_CLE
FSMC_A17: U2.23(A17) U3.17(ALE) ; port FSMC_A17_ALE
FSMC_A18: U2.28(A18) ; port FSMC_A18
FSMC_D0: U1.2(DQ0) U2.7(I/O0) U3.29(I/O0) ; port FSMC_D0
FSMC_D1: U1.4(DQ1) U2.8(I/O1) U3.30(I/O1) ; port FSMC_D1
FSMC_D2: U1.5(DQ2) U2.9(I/O2) U3.31(I/O2) ; port FSMC_D2
FSMC_D3: U1.7(DQ3) U2.10(I/O3) U3.32(I/O3) ; port FSMC_D3
FSMC_D4: U1.8(DQ4) U2.13(I/O4) U3.41(I/O4) ; port FSMC_D4
FSMC_D5: U1.10(DQ5) U2.14(I/O5) U3.42(I/O5) ; port FSMC_D5
FSMC_D6: U1.11(DQ6) U2.15(I/O6) U3.43(I/O6) ; port FSMC_D6
FSMC_D7: U1.13(DQ7) U2.16(I/O7) U3.44(I/O7) ; port FSMC_D7
FSMC_D8: U1.42(DQ8) U2.29(I/O8) U3.26(I/O8) ; port FSMC_D8
FSMC_D9: U1.44(DQ9) U2.30(I/O9) U3.27(I/O9) ; port FSMC_D9
FSMC_D10: U1.45(DQ10) U2.31(I/O10) U3.28(I/O10) ; port FSMC_D10
FSMC_D11: U1.47(DQ11) U2.32(I/O11) U3.33(I/O11) ; port FSMC_D11
FSMC_D12: U1.48(DQ12) U2.35(I/O12) U3.40(I/O12) ; port FSMC_D12
FSMC_D13: U1.50(DQ13) U2.36(I/O13) U3.45(I/O13) ; port FSMC_D13
FSMC_D14: U1.51(DQ14) U2.37(I/O14) U3.46(I/O14) ; port FSMC_D14
FSMC_D15: U1.53(DQ15) U2.38(I/O15) U3.47(I/O15) ; port FSMC_D15
FSMC_NOE: U2.41(OE) U3.8(~{RE}) ; port FSMC_NOE
FSMC_NWE: U2.17(WE) U3.18(~{WE}) ; port FSMC_NWE
FSMC_SDCKE0: U1.37(CKE) ; port FSMC_SDCKE0
FSMC_SDCLK: U1.38(CLK) ; port FSMC_SDCLK
FSMC_SDNE0: U1.19(~{CS}) ; port FSMC_SDNE0
FSMC_SDNRAS: U1.18(~{RAS}) ; port FSMC_SDNRAS
FSMC_SDNWE: U1.16(~{WE}) ; port FSMC_SDNWE
LTDC_BL: J1.34 ; port LTDC_BL
LTDC_DE: J1.33 ; port LTDC_DE
PA3: J1.26 ; port LTDC_B5
PA5: J1.38 ; port SPI1_SCK
PA8: J1.24 ; port LTDC_B3
PA10: J1.25 ; port LTDC_B4
PC0: J1.8 ; port LTDC_R5
PC6: U3.7(R/~{B}) ; port FSMC_NWAIT
PC7: R1.1 U2.6(CE) ; port FSMC_NE1
PE0: U1.15(LDQM) U2.39(LB) ; port FSMC_NBL0
PE1: U1.39(UDQM) U2.40(UB) ; port FSMC_NBL1
PG6: J1.10 ; port LTDC_R7
PG7: J1.30 ; port LTDC_CLK
PG9: U3.9(~{CE}) ; port FSMC_NCE
PG15: U1.17(~{CAS}) ; port FSMC_SDNCAS
PH4: J1.17 ; port LTDC_G5
PH9: J1.6 ; port LTDC_R3
PH10: J1.7 ; port LTDC_R4
PH12: J1.9 ; port LTDC_R6
PH13: J1.14 ; port LTDC_G2
PH14: J1.15 ; port LTDC_G3
PH15: J1.16 ; port LTDC_G4
PI2: J1.19 ; port LTDC_G7
PI6: J1.27 ; port LTDC_B6
PI7: J1.28 ; port LTDC_B7
PI9: J1.32 ; port LTDC_VSYNC
PI10: J1.31 ; port LTDC_HSYNC
PI11: J1.18 ; port LTDC_G6
RESET: J1.40 ; port RESET
SPI1_CS1: J1.35 ; port SPI1_CS1  [project net PH8]
SPI1_MISO: J1.37 ; port SPI1_MISO  [project net PA6]
SPI1_MOSI: J1.36 ; port SPI1_MOSI  [project net PD7]
SPI1_SCK: port SP1_SCK
T_OPEN: J1.39 ; port T_OPEN
NetC11_1: C11.1 C12.1 R2.2 U3.12(VCC) U3.37(VCC)
NetR3_2: R3.2 U3.19(~{WP})

Not connected (* = marked no-connect by the designer): U2 12(GND) 33(VDD)

### Notes on the sheet
- NAND FLASH
- SDRAM
- (near J1) LTDC_LCD

### Library data of the parts
C1-C12 = C
J1 = FPC-40: FPC-40P-0.5mm
R1-R3 = RES
U1 = IS42S16160B: 32MB SDRAM

## Nets that join several sheets
DGND: MCU_H (47 pins), FLASH_SRAM (35 pins)
VCC3.3D: MCU_H (48 pins), FLASH_SRAM (20 pins)
FSMC_A0: MCU_H (U7.16), FLASH_SRAM (U1.23 U2.5)
FSMC_A1: MCU_H (U7.17), FLASH_SRAM (U1.24 U2.4)
FSMC_A2: MCU_H (U7.18), FLASH_SRAM (U1.25 U2.3)
FSMC_A3: MCU_H (U7.19), FLASH_SRAM (U1.26 U2.2)
FSMC_A4: MCU_H (U7.20), FLASH_SRAM (U1.29 U2.1)
FSMC_A5: MCU_H (U7.21), FLASH_SRAM (U1.30 U2.44)
FSMC_A6: MCU_H (U7.60), FLASH_SRAM (U1.31 U2.43)
FSMC_A7: MCU_H (U7.63), FLASH_SRAM (U1.32 U2.42)
FSMC_A8: MCU_H (U7.64), FLASH_SRAM (U1.33 U2.27)
FSMC_A9: MCU_H (U7.65), FLASH_SRAM (U1.34 U2.26)
FSMC_A10: MCU_H (U7.66), FLASH_SRAM (U1.22 U2.25)
FSMC_A11: MCU_H (U7.67), FLASH_SRAM (U1.35 U2.24)
FSMC_A12: MCU_H (U7.106), FLASH_SRAM (U1.36 U2.22)
FSMC_A13: MCU_H (U7.107), FLASH_SRAM (U2.21)
FSMC_A14: MCU_H (U7.108), FLASH_SRAM (U1.20 U2.20)
FSMC_A15: MCU_H (U7.109), FLASH_SRAM (U1.21 U2.19)
FSMC_A16: MCU_H (U7.99), FLASH_SRAM (U2.18 U3.16)
FSMC_A17: MCU_H (U7.100), FLASH_SRAM (U2.23 U3.17)
FSMC_A18: MCU_H (U7.101), FLASH_SRAM (U2.28)
FSMC_D0: MCU_H (U7.104), FLASH_SRAM (U1.2 U2.7 U3.29)
FSMC_D1: MCU_H (U7.105), FLASH_SRAM (U1.4 U2.8 U3.30)
FSMC_D2: MCU_H (U7.142), FLASH_SRAM (U1.5 U2.9 U3.31)
FSMC_D3: MCU_H (U7.143), FLASH_SRAM (U1.7 U2.10 U3.32)
FSMC_D4: MCU_H (U7.68), FLASH_SRAM (U1.8 U2.13 U3.41)
FSMC_D5: MCU_H (U7.69), FLASH_SRAM (U1.10 U2.14 U3.42)
FSMC_D6: MCU_H (U7.70), FLASH_SRAM (U1.11 U2.15 U3.43)
FSMC_D7: MCU_H (U7.73), FLASH_SRAM (U1.13 U2.16 U3.44)
FSMC_D8: MCU_H (U7.74), FLASH_SRAM (U1.42 U2.29 U3.26)
FSMC_D9: MCU_H (U7.75), FLASH_SRAM (U1.44 U2.30 U3.27)
FSMC_D10: MCU_H (U7.76), FLASH_SRAM (U1.45 U2.31 U3.28)
FSMC_D11: MCU_H (U7.77), FLASH_SRAM (U1.47 U2.32 U3.33)
FSMC_D12: MCU_H (U7.78), FLASH_SRAM (U1.48 U2.35 U3.40)
FSMC_D13: MCU_H (U7.96), FLASH_SRAM (U1.50 U2.36 U3.45)
FSMC_D14: MCU_H (U7.97), FLASH_SRAM (U1.51 U2.37 U3.46)
FSMC_D15: MCU_H (U7.98), FLASH_SRAM (U1.53 U2.38 U3.47)
FSMC_NOE: MCU_H (U7.146), FLASH_SRAM (U2.41 U3.8)
FSMC_NWE: MCU_H (U7.147), FLASH_SRAM (U2.17 U3.18)
FSMC_SDCKE0: MCU_H (U7.43), FLASH_SRAM (U1.37)
FSMC_SDCLK: MCU_H (U7.112), FLASH_SRAM (U1.38)
FSMC_SDNE0: MCU_H (U7.44), FLASH_SRAM (U1.19)
FSMC_SDNRAS: MCU_H (U7.59), FLASH_SRAM (U1.18)
FSMC_SDNWE: MCU_H (U7.46), FLASH_SRAM (U1.16)
LTDC_DE: MCU_H (U7.28), FLASH_SRAM (J1.33)
PA3: MCU_H (U7.47), FLASH_SRAM (J1.26)
PA5: MCU_H (U7.51 U8.6), FLASH_SRAM (J1.38)
PA6: MCU_H (U7.52 U8.5), FLASH_SRAM (J1.37)
PA8: MCU_H (U7.119), FLASH_SRAM (J1.24)
PA10: MCU_H (U7.121), FLASH_SRAM (J1.25)
PC0: MCU_H (U7.32), FLASH_SRAM (J1.8)
PC6: MCU_H (U7.115), FLASH_SRAM (U3.7)
PC7: MCU_H (U7.116), FLASH_SRAM (R1.1 U2.6)
PD7: MCU_H (U7.151 U8.2), FLASH_SRAM (J1.36)
PE0: MCU_H (U7.169), FLASH_SRAM (U1.15 U2.39)
PE1: MCU_H (U7.170), FLASH_SRAM (U1.39 U2.40)
PG6: MCU_H (U7.110), FLASH_SRAM (J1.10)
PG7: MCU_H (U7.111), FLASH_SRAM (J1.30)
PG9: MCU_H (U7.152), FLASH_SRAM (U3.9)
PG15: MCU_H (U7.160), FLASH_SRAM (U1.17)
PH4: MCU_H (U7.45), FLASH_SRAM (J1.17)
PH8: MCU_H (U7.85), FLASH_SRAM (J1.35)
PH9: MCU_H (U7.86), FLASH_SRAM (J1.6)
PH10: MCU_H (U7.87), FLASH_SRAM (J1.7)
PH12: MCU_H (U7.89), FLASH_SRAM (J1.9)
PH13: MCU_H (U7.128), FLASH_SRAM (J1.14)
PH14: MCU_H (U7.129), FLASH_SRAM (J1.15)
PH15: MCU_H (U7.130), FLASH_SRAM (J1.16)
PI2: MCU_H (U7.133), FLASH_SRAM (J1.19)
PI6: MCU_H (U7.175), FLASH_SRAM (J1.27)
PI7: MCU_H (U7.176), FLASH_SRAM (J1.28)
PI9: MCU_H (U7.11), FLASH_SRAM (J1.32)
PI10: MCU_H (U7.12), FLASH_SRAM (J1.31)
PI11: MCU_H (U7.13), FLASH_SRAM (J1.18)
RESET: MCU_H (5 pins), FLASH_SRAM (J1.40)